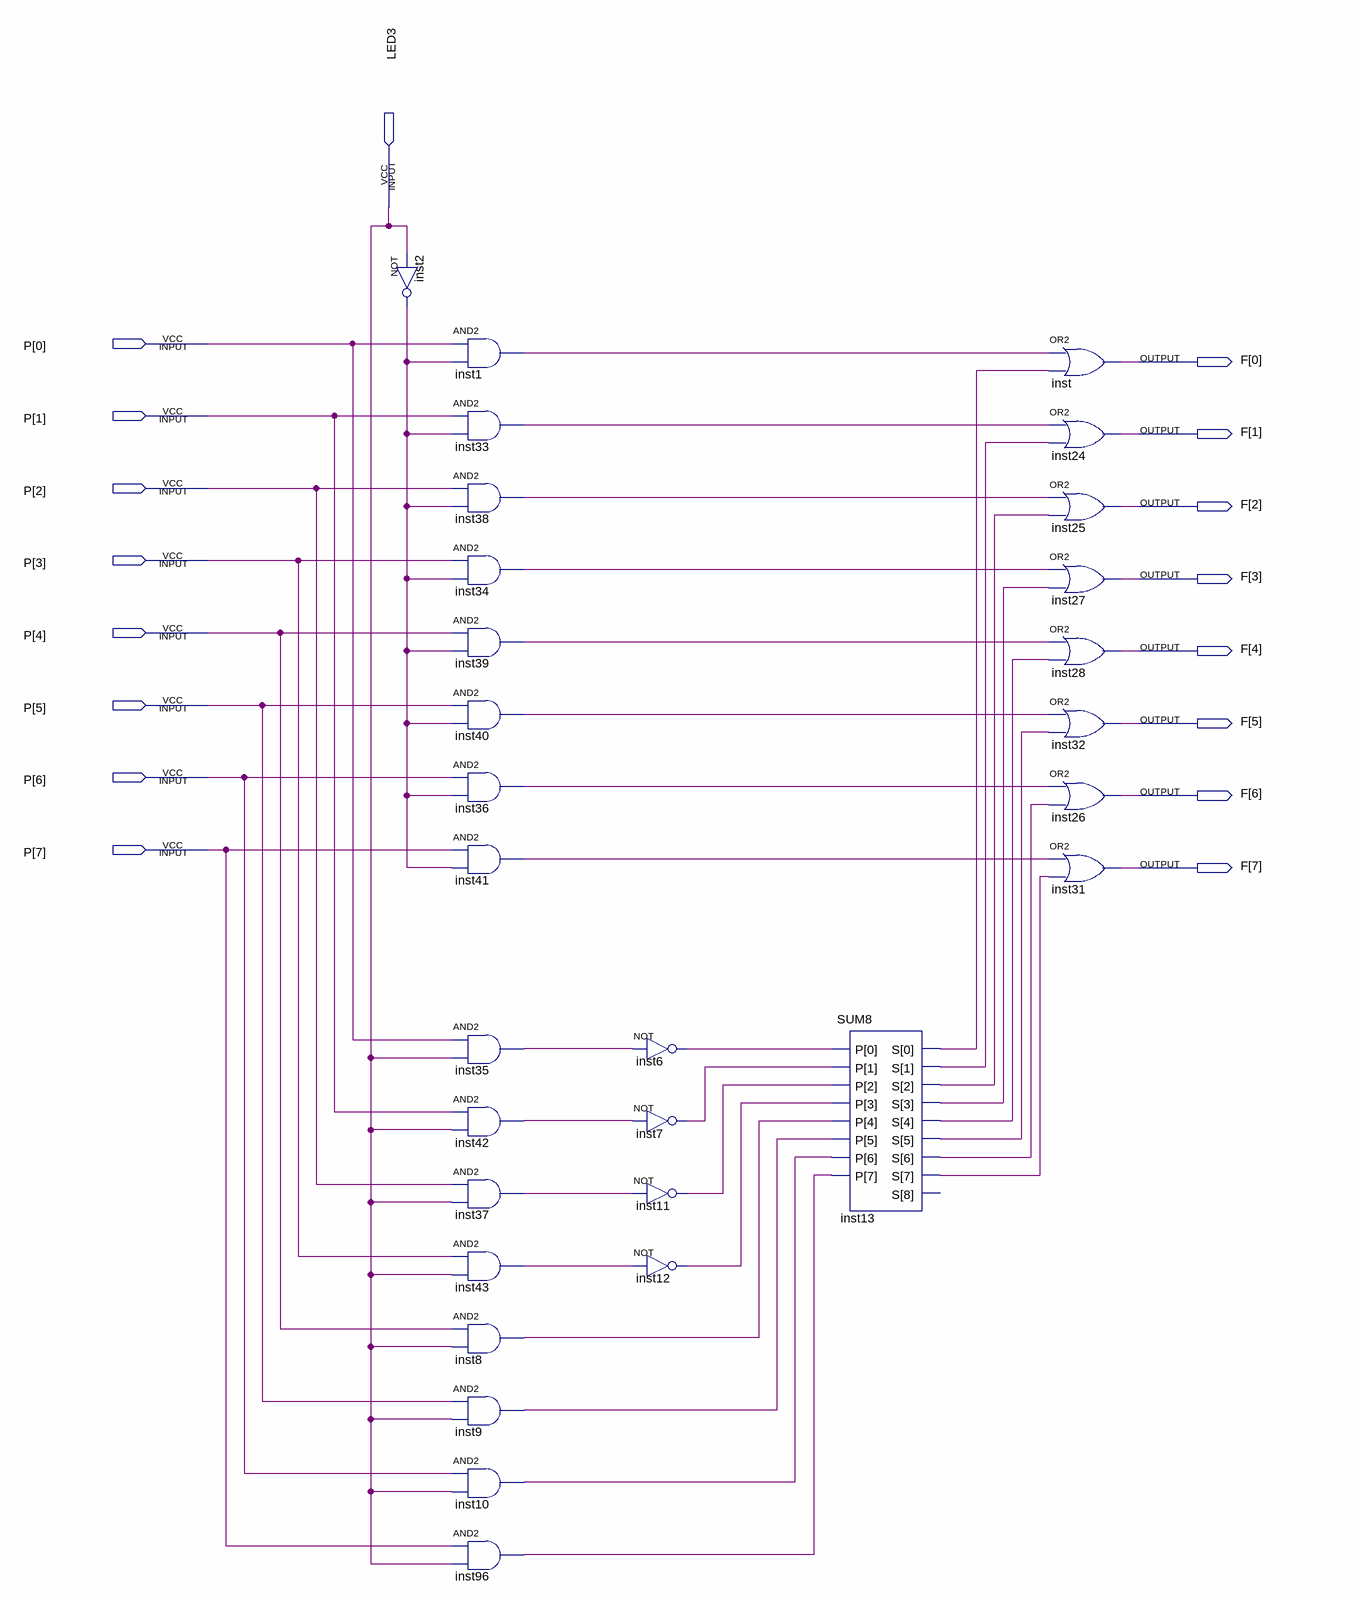
[diagram p0: schematic sheet]
// Quartus schematic b1].bdf as structural Verilog: 30 symbols, 17 pins
module \b1]  (
  input  LED3,
  input  [7:0] P,
  output [7:0] F
);

  wire inst1_out, inst2_out, inst6_out, inst7_out, inst8_out, inst9_out, inst10_out, inst11_out, inst12_out,
       inst13_s, inst13_s_2, inst13_s_3, inst13_s_4, inst13_s_5, inst13_s_6, inst13_s_7, inst13_s_8,
       inst33_out, inst34_out, inst35_out, inst36_out, inst37_out, inst38_out, inst39_out, inst40_out,
       inst41_out, inst42_out, inst43_out, inst96_out;
  wire [8:0] inst13_s_open;  // unused outputs

  not inst2 (inst2_out, LED3);
  and inst1 (inst1_out, P[0], inst2_out);
  and inst33 (inst33_out, P[1], inst2_out);
  and inst38 (inst38_out, P[2], inst2_out);
  and inst34 (inst34_out, P[3], inst2_out);
  and inst39 (inst39_out, P[4], inst2_out);
  and inst40 (inst40_out, P[5], inst2_out);
  and inst36 (inst36_out, P[6], inst2_out);
  and inst41 (inst41_out, P[7], inst2_out);
  and inst35 (inst35_out, P[0], LED3);
  and inst42 (inst42_out, P[1], LED3);
  and inst37 (inst37_out, P[2], LED3);
  and inst43 (inst43_out, P[3], LED3);
  and inst8 (inst8_out, P[4], LED3);
  and inst9 (inst9_out, P[5], LED3);
  and inst10 (inst10_out, P[6], LED3);
  and inst96 (inst96_out, P[7], LED3);
  not inst6 (inst6_out, inst35_out);
  not inst7 (inst7_out, inst42_out);
  not inst11 (inst11_out, inst37_out);
  not inst12 (inst12_out, inst43_out);
  SUM8 inst13 (
    .P({inst96_out, inst10_out, inst9_out, inst8_out, inst12_out, inst11_out, inst7_out, inst6_out}),
    .S({inst13_s_open[8], inst13_s_2, inst13_s_8, inst13_s_7, inst13_s, inst13_s_6, inst13_s_5, inst13_s_4, inst13_s_3}));
  or inst (F[0], inst1_out, inst13_s_3);
  or inst24 (F[1], inst33_out, inst13_s_4);
  or inst25 (F[2], inst38_out, inst13_s_5);
  or inst27 (F[3], inst34_out, inst13_s_6);
  or inst28 (F[4], inst39_out, inst13_s);
  or inst32 (F[5], inst40_out, inst13_s_7);
  or inst26 (F[6], inst36_out, inst13_s_8);
  or inst31 (F[7], inst41_out, inst13_s_2);
endmodule
